# EAGLE design CHESSmate CPU (EAGLE 9.6.2)
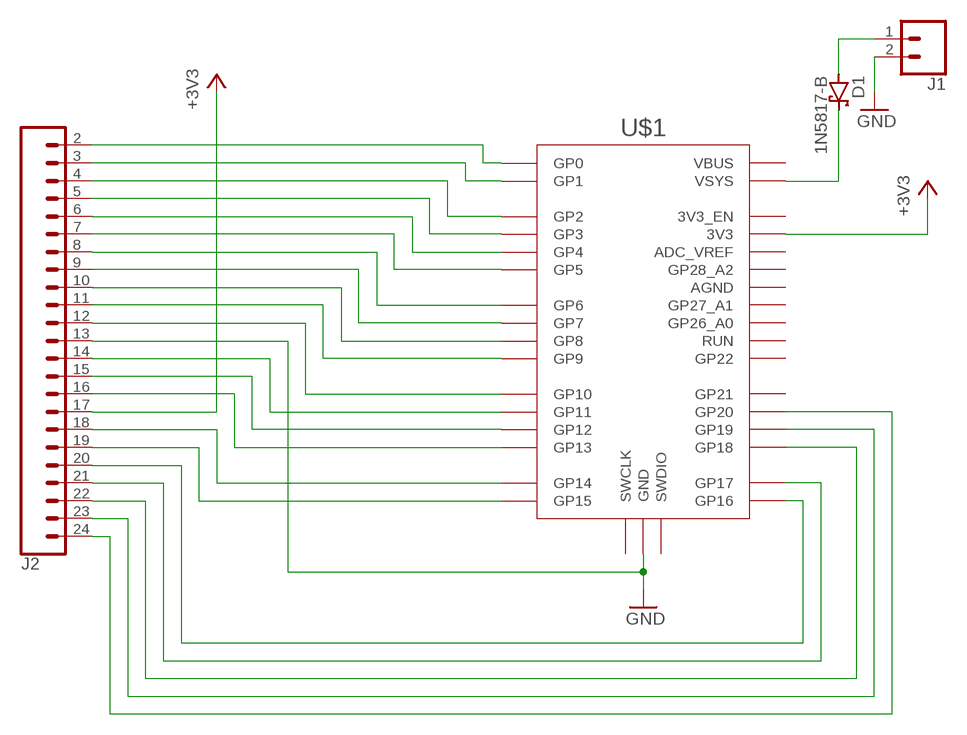
[diagram p0: schematic, sheet 1]

## Parts
D1  1N5817-B  [DO41-7.6]
J1  CONN_02  [1X02]
J2  CONN_23  [1X23]
U$1  RPI_PICO-TH  [RPI_PICO_TH]

## Nets
+3V3: J2.17 U$1.3V3
GND: J1.2 J2.13 U$1.GND@1(GND) U$1.GND@2(GND) U$1.GND@3(GND) U$1.GND@4(GND) U$1.GND@5(GND) U$1.GND@6(GND) U$1.GND@7(GND) U$1.GND@8(GND)
N$1: D1.C U$1.VSYS
N$2: D1.A J1.1
N$3: J2.2 U$1.GP0
N$4: J2.3 U$1.GP1
N$5: J2.4 U$1.GP2
N$6: J2.5 U$1.GP3
N$7: J2.6 U$1.GP4
N$8: J2.7 U$1.GP5
N$9: J2.8 U$1.GP6
N$10: J2.9 U$1.GP7
N$11: J2.10 U$1.GP8
N$12: J2.11 U$1.GP9
N$13: J2.14 U$1.GP11
N$14: J2.12 U$1.GP10
N$15: J2.15 U$1.GP12
N$16: J2.20 U$1.GP16
N$17: J2.21 U$1.GP17
N$18: J2.16 U$1.GP13
N$19: J2.18 U$1.GP14
N$20: J2.19 U$1.GP15
N$21: J2.22 U$1.GP18
N$22: J2.23 U$1.GP19
N$23: J2.24 U$1.GP20
Unconnected: U$1.3V3_EN U$1.ADC_VREF U$1.AGND U$1.GP21 U$1.GP22 U$1.GP26_A0 U$1.GP27_A1 U$1.GP28_A2 U$1.RUN U$1.SWCLK U$1.SWDIO U$1.VBUS

## Library data of the parts
D1 = diode:1N581*: 1.0A SCHOTTKY BARRIER RECTIFIER Source: http://www.diodes.com/datasheets/ds23001.pdf
J1 = SparkFun-Connectors:CONN_02: Multi connection point. Often used as Generic Header-pin footprint for 0.1 inch spaced/style header connections On any of the 0.1 inch spaced packages, you can populate with these: Break Away Headers - Straight <https://www.sparkfun.com/products/116> (PRT-00116) Break Away Male Headers - Right Angle <https://www.sparkfun.com/products/553> (PRT-00553) Female Headers <https://www.sparkfun.com/products/115> (PRT-00115) Break Away Headers - Machine Pin <https://www.sparkfun.com/products/117> (PRT-00117) Break Away Female Headers - Swiss Machine Pin <https://www.sparkfun.com/products/743> (PRT-00743) For SCREWTERMINALS and SPRING TERMINALS visit here: Screw Terimnals on SparkFun.com <https://www.sparkfun.com/search/results?term=Screw+Terminals> (5mm/3.5mm/2.54mm spacing) This device is also useful as a general connection point to wire up your design to another part of your project. Our various solder wires solder well into these plated through hole pads. Hook-Up Wire - Assortment (Stranded, 22 AWG) <https://www.sparkfun.com/products/11375> (PRT-11375) Hook-Up Wire - Assortment (Solid Core, 22 AWG) <https://www.sparkfun.com/products/11367> (PRT-11367) View the entire wire category on our website here <https://www.sparkfun.com/categories/141> Special notes: Molex polarized connector foot print use with: PRT-08233 with associated crimp pins and housings. 2.54_SCREWTERM for use with PRT-10571. 3.5mm Screw Terminal footprints for PRT-08084 5mm Screw Terminal footprints for use with PRT-08432
J2 = SparkFun-Connectors:CONN_23: Multi connection point. Often used as Generic Header-pin footprint for 0.1 inch spaced/style header connections On any of the 0.1 inch spaced packages, you can populate with these: Break Away Headers - Straight <https://www.sparkfun.com/products/116> (PRT-00116) Break Away Male Headers - Right Angle <https://www.sparkfun.com/products/553> (PRT-00553) Female Headers <https://www.sparkfun.com/products/115> (PRT-00115) Break Away Headers - Machine Pin <https://www.sparkfun.com/products/117> (PRT-00117) Break Away Female Headers - Swiss Machine Pin <https://www.sparkfun.com/products/743> (PRT-00743) For SCREWTERMINALS and SPRING TERMINALS visit here: Screw Terimnals on SparkFun.com <https://www.sparkfun.com/search/results?term=Screw+Terminals> (5mm/3.5mm/2.54mm spacing) This device is also useful as a general connection point to wire up your design to another part of your project. Our various solder wires solder well into these plated through hole pads. Hook-Up Wire - Assortment (Stranded, 22 AWG) <https://www.sparkfun.com/products/11375> (PRT-11375) Hook-Up Wire - Assortment (Solid Core, 22 AWG) <https://www.sparkfun.com/products/11367> (PRT-11367) View the entire wire category on our website here <https://www.sparkfun.com/categories/141> Special notes: Molex polarized connector foot print use with SKU : PRT-08231 with associated crimp pins and housings. 1MM SMD Version SKU: PRT-10208 NOTES ON THE VARIANTS LOCK and LOCK_LONGPADS... This footprint was designed to help hold the alignment of a through-hole component (i.e. 6-pin header) while soldering it into place. You may notice that each hole has been shifted either up or down by 0.005 of an inch from it's more standard position (which is a perfectly straight line). This slight alteration caused the pins (the squares in the middle) to touch the edges of the holes. Because they are alternating, it causes a "brace" to hold the component in place. 0.005 has proven to be the perfect amount of "off-center" position when using our standard breakaway headers. Although looks a little odd when you look at the bare footprint, once you have a header in there, the alteration is very hard to notice. Also,if you push a header all the way into place, it is covered up entirely on the bottom side.
U$1 = RaspberryPi_Pico:RPI_PICO

## Board
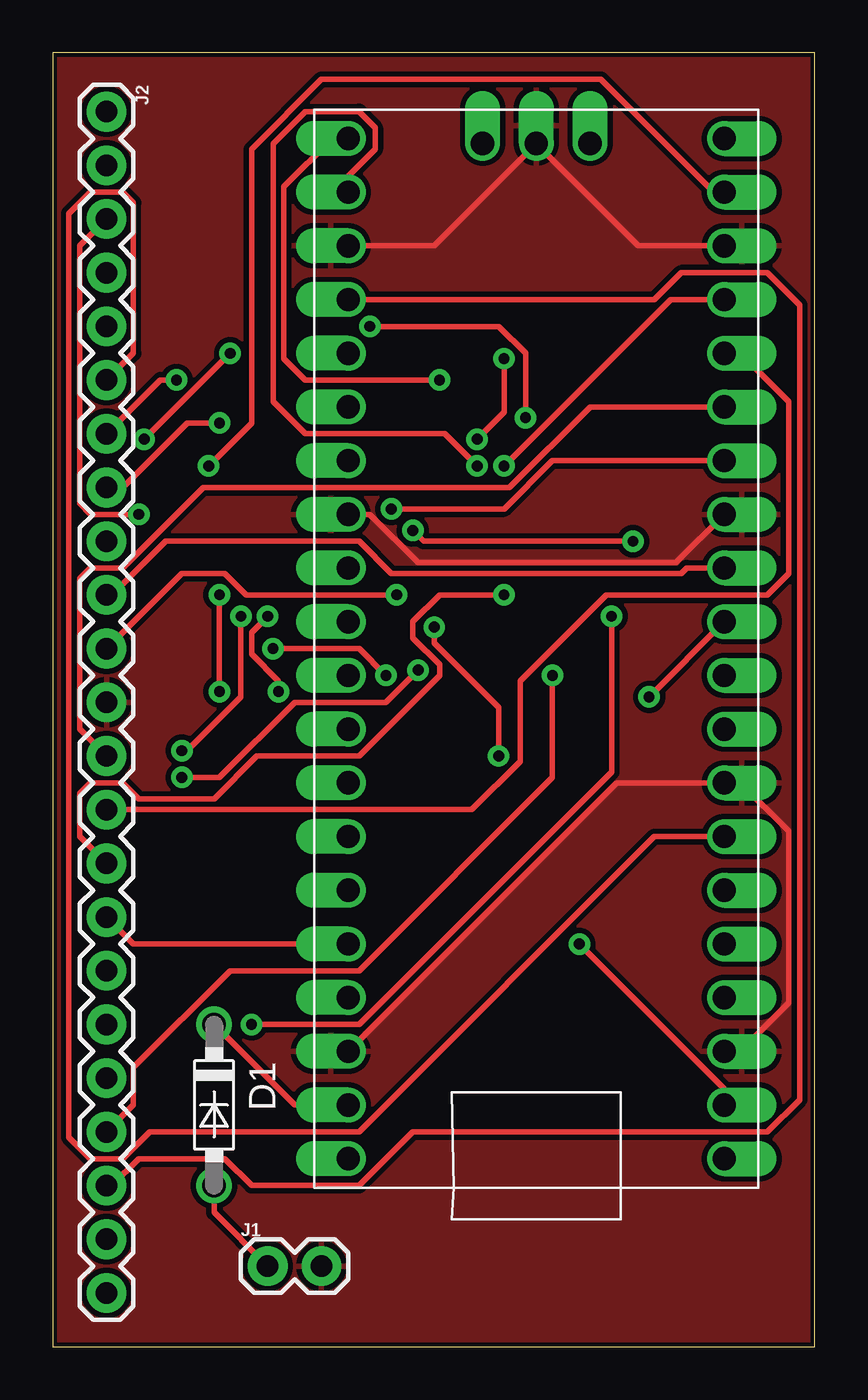
[diagram p1: board, top side]
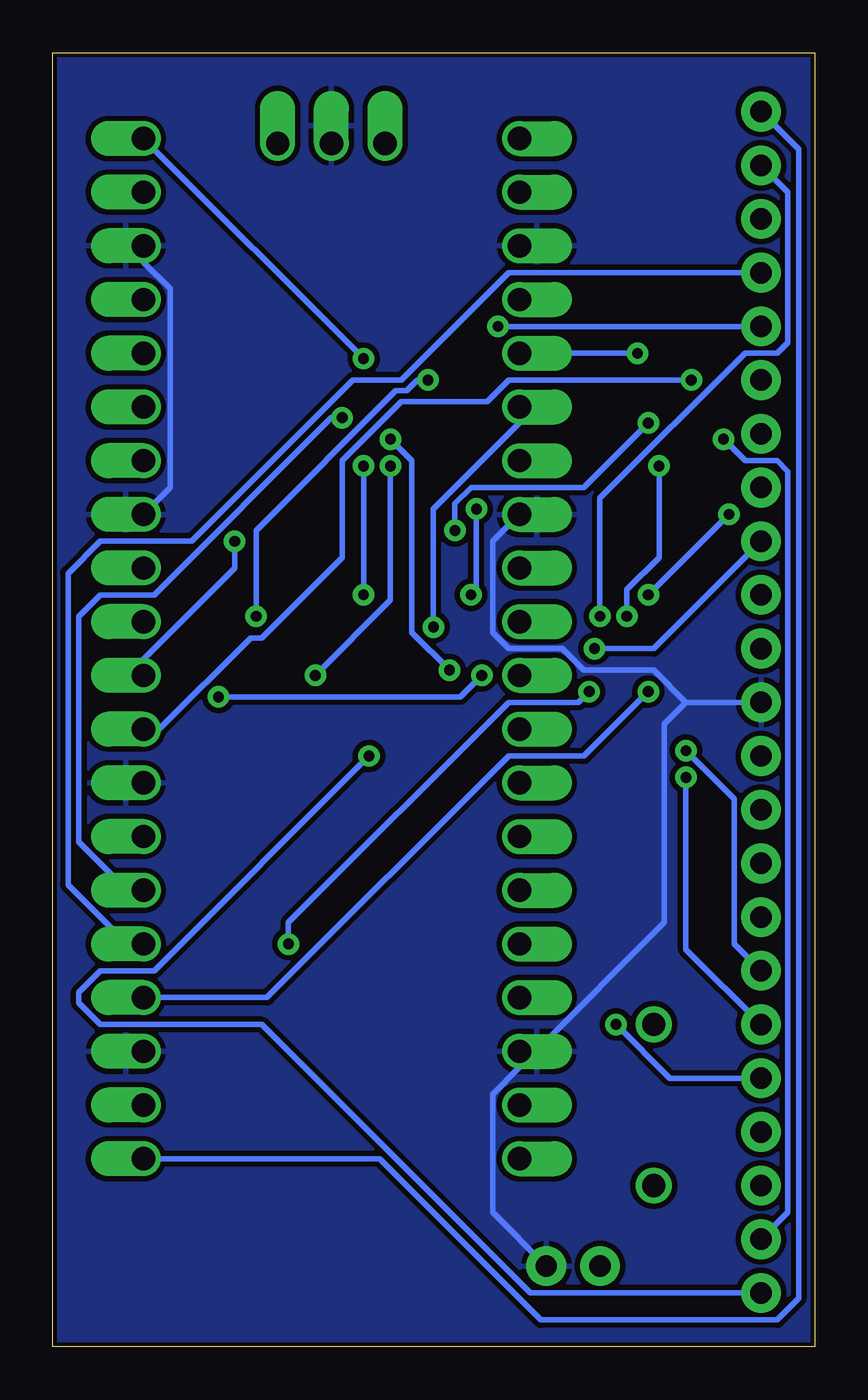
[diagram p2: board, bottom side, seen from below]

Size 36.03 x 61.2 mm. Coordinates in mm from the lower left corner, seen from the top.
Outline: 0,0 36.03,0 36.03,61.2 0,61.2 0,0
Copper layers (1*16): Top 0.035mm / dielectric 1.5mm / Bottom 0.035mm
Design rules "RetroSpy-2-layer-STANDARD": minimum track width 10mil, minimum drill 20mil, track to track 10mil, track to pad 8mil, pad to pad 8mil, via to via 10mil, smd to smd 8mil, copper to edge 8mil, drill to drill 8mil, minimum pad ring 10mil, minimum via ring 10mil, stop-mask expansion 4mil, vias tented up to drill 25mil, thermal gap 10mil

### Footprints (pad centres in the part's own frame; a part is rotated, then mirrored left to right if it is on the bottom)
DO41-7.6 = drill 1.1 pad 1.7: A 3.81,0; C -3.81,0
1X02 = drill 1.016 pad 1.88: 1 0,0; 2 2.54,0
1X23 = drill 1.016 pad 1.88: 2 -26.67,0; 3 -24.13,0; 4 -21.59,0; 5 -19.05,0; 6 -16.51,0; 7 -13.97,0; 8 -11.43,0; 9 -8.89,0; 10 -6.35,0; 11 -3.81,0; 12 -1.27,0; 13 1.27,0; 14 3.81,0; 15 6.35,0; 16 8.89,0; 17 11.43,0; 18 13.97,0; 19 16.51,0; 20 19.05,0; 21 21.59,0; 22 24.13,0; 23 26.67,0; 24 29.21,0
RPI_PICO_TH = drill 1.1 pad 1.6 offset: 3V3 8.89,13.97; 3V3_EN 8.89,16.51; ADC_VREF 8.89,11.43; AGND 8.89,6.35; GND@1 -8.89,19.05; GND@2 -8.89,6.35; GND@3 -8.89,-6.35; GND@4 -8.89,-19.05; GND@5 0,-23.9; GND@6 8.89,-19.05; GND@7 8.89,-6.35; GND@8 8.89,19.05; GP0 -8.89,24.13; GP1 -8.89,21.59; GP2 -8.89,16.51; GP3 -8.89,13.97; GP4 -8.89,11.43; GP5 -8.89,8.89; GP6 -8.89,3.81; GP7 -8.89,1.27; GP8 -8.89,-1.27; GP9 -8.89,-3.81; GP10 -8.89,-8.89; GP11 -8.89,-11.43; GP12 -8.89,-13.97; GP13 -8.89,-16.51; GP14 -8.89,-21.59; GP15 -8.89,-24.13; GP16 8.89,-24.13; GP17 8.89,-21.59; GP18 8.89,-16.51; GP19 8.89,-13.97; GP20 8.89,-11.43; GP21 8.89,-8.89; GP22 8.89,-3.81; GP26_A0 8.89,1.27; GP27_A1 8.89,3.81; GP28_A2 8.89,8.89; RUN 8.89,-1.27; SWCLK -2.54,-23.9; SWDIO 2.54,-23.9; VBUS 8.89,24.13; VSYS 8.89,21.59

### Placement (x,y rotation side)
D1  7.62,11.43 270 top
J1  10.16,3.81 0 top
J2  2.54,31.75 270 top
U$1  22.86,33.02 180 top

### Tracks (layer width: path | path; a pad name or v marks a point on that pad's centre or on a via)
+3V3
  Top 0.254: U$1.3V3 3.81,19.05 J2.17
GND
  Top 0.254: U$1.GND@6 18.03,52.07 22.86,56.9 | U$1.GND@4 27.69,52.07 22.86,56.9 | 22.86,56.9 U$1.GND@5 | U$1.GND@1 32.51,13.97 34.8,16.26 34.8,24.38 32.51,26.67 U$1.GND@2 26.67,26.67 U$1.GND@8 | U$1.GND@7 14.99,39.37 17.27,37.08 29.46,37.08 U$1.GND@3
  Bottom 0.254: J1.2 15.24,6.35 15.24,11.94 13.97,13.21 U$1.GND@8 13.21,13.97 7.11,20.07 7.11,29.46 6.1,30.48 | 6.1,30.48 J2.13 | 6.1,30.48 7.62,32 10.92,32 11.94,33.02 14.48,33.02 15.24,33.78 15.24,38.1 U$1.GND@7 | U$1.GND@4 31.75,51.31 30.48,50.04 30.48,40.64 U$1.GND@3
  pour Top: 0,62.23 36.83,62.23 36.83,0 0,0
  pour Bottom: 0,62.23 36.83,62.23 36.83,0 0,0
N$1
  Top 0.254: U$1.VSYS 11.43,11.43 D1.C
N$2
  Top 0.254: D1.A 7.62,6.35 J1.1
N$3
  Bottom 0.254: U$1.GP0 20.57,8.89 12.95,1.27 1.78,1.27 0.76,2.29 0.76,56.64 J2.2
N$4  (via drill 0.51)
  Top 0.254: U$1.GP1 31.75,12.19 v24.89,19.05 | v10.67,30.99 10.67,31.5 9.4,32.77 9.4,33.78 v10.16,34.54
  Bottom 0.254: v24.89,19.05 24.89,20.07 14.48,30.48 11.18,30.48 v10.67,30.99 | v10.16,34.54 10.16,40.13 3.3,46.99 1.78,46.99 1.27,47.5 1.27,54.61 J2.3
N$5  (via drill 0.51)
  Top 0.254: v7.87,35.56 v7.87,30.99 | v4.06,39.37 1.78,39.37 1.27,39.88 1.27,52.07 J2.4
  Bottom 0.254: U$1.GP2 25.91,16.51 14.48,27.94 10.92,27.94 v7.87,30.99 | v4.06,39.37 v7.87,35.56
N$6
  Bottom 0.254: U$1.GP3 32.51,19.05 35.31,21.84 35.31,36.58 33.78,38.1 29.46,38.1 21.84,45.72 19.56,45.72 14.48,50.8 J2.5
N$7  (via drill 0.51)
  Top 0.254: v22.35,43.94 22.35,46.99 21.08,48.26 v14.99,48.26
  Bottom 0.254: U$1.GP4 32.51,21.59 34.8,23.88 34.8,34.54 33.78,35.56 31.24,35.56 22.86,43.94 v22.35,43.94 | J2.6 v14.99,48.26
N$8
  Top 0.254: U$1.GP5 28.45,24.13 14.48,10.16 4.57,10.16 3.3,8.89 1.78,8.89 0.76,9.91 0.76,53.59 1.78,54.61 3.3,54.61 3.81,54.1 3.81,46.99 J2.7
N$9  (via drill 0.51)
  Top 0.254: v5.84,45.72 5.08,45.72 J2.8
  Bottom 0.254: U$1.GP6 30.99,29.21 26.67,33.53 26.16,33.53 22.35,37.34 22.35,41.91 19.56,44.7 15.49,44.7 14.48,45.72 v5.84,45.72
N$10  (via drill 0.51)
  Top 0.254: v27.43,38.1 17.53,38.1 v17.02,38.61 | v7.87,43.69 6.35,43.69 3.3,40.64 J2.9
  Bottom 0.254: U$1.GP7 31.75,32.51 27.43,36.83 v27.43,38.1 | v17.02,38.61 17.02,39.88 16.26,40.64 10.92,40.64 v7.87,43.69
N$11  (via drill 0.51)
  Top 0.254: v28.19,30.73 U$1.GP8 | v15.75,31.75 14.48,33.02 v10.41,33.02
  Bottom 0.254: v28.19,30.73 16.76,30.73 v15.75,31.75 | v10.41,33.02 7.62,33.02 J2.10
N$12
  Top 0.254: U$1.GP9 29.97,36.83 29.72,36.58 16,36.58 14.48,38.1 5.33,38.1 2.79,35.56 J2.11
N$13
  Top 0.254: U$1.GP11 25.4,44.45 21.59,40.64 7.11,40.64 3.3,36.83 1.78,36.83 1.27,36.32 1.27,29.21 J2.14
N$14  (via drill 0.51)
  Top 0.254: U$1.GP10 23.62,41.91 21.34,39.62 v16,39.62 | v16.26,35.56 9.14,35.56 8.13,36.58 6.1,36.58 J2.12
  Bottom 0.254: v16,39.62 16,35.81 v16.26,35.56
N$15
  Top 0.254: U$1.GP12 32.51,46.99 34.8,44.7 34.8,36.58 33.78,35.56 26.16,35.56 22.1,31.5 22.1,27.69 19.81,25.4 J2.15
N$16  (via drill 0.51)
  Top 0.254: U$1.GP16 13.21,57.15 10.92,54.86 10.92,46.74 11.94,45.72 v18.29,45.72 | v26.42,34.54 26.42,27.18 14.48,15.24 v9.4,15.24
  Bottom 0.254: v18.29,45.72 18.8,45.72 19.3,45.21 19.81,45.21 26.42,38.61 v26.42,34.54 | v9.4,15.24 6.86,12.7 J2.20
N$17  (via drill 0.51)
  Top 0.254: U$1.GP17 13.97,55.37 15.24,56.64 15.24,57.66 14.48,58.42 11.94,58.42 10.41,56.9 10.41,44.7 11.94,43.18 18.54,43.18 v20.07,41.66 | v23.62,31.75 23.62,26.92 14.48,17.78 8.38,17.78 3.81,13.21 3.81,11.43 J2.21
  Bottom 0.254: v20.07,41.66 20.07,35.31 v23.62,31.75
N$18  (via drill 0.51)
  Top 0.254: U$1.GP13 29.21,49.53 v21.34,41.66 | v21.34,35.56 18.29,35.56 17.02,34.29 17.02,33.53 18.29,32.26 18.29,31.75 14.48,27.94 9.65,27.94 7.62,25.91 4.06,25.91 3.3,26.67 1.78,26.67 1.27,26.16 1.27,24.13 J2.16
  Bottom 0.254: v21.34,35.56 v21.34,41.66
N$19  (via drill 0.51)
  Top 0.254: U$1.GP14 31.24,54.61 25.91,59.94 12.7,59.94 9.4,56.64 9.4,43.69 v7.37,41.66 | v8.89,34.54 8.89,30.73 6.35,28.19 v6.1,28.19
  Bottom 0.254: v7.37,41.66 7.37,37.34 8.89,35.81 v8.89,34.54 | v6.1,28.19 3.81,25.91 3.81,19.05 J2.18
N$20  (via drill 0.51)
  Top 0.254: v21.34,46.74 21.34,44.2 v20.07,42.93 | v17.27,32 15.75,30.48 11.43,30.48 7.87,26.92 v6.1,26.92
  Bottom 0.254: v21.34,46.74 U$1.GP15 | v20.07,42.93 19.05,41.91 19.05,33.78 v17.27,32 | v6.1,26.92 6.1,18.8 J2.19
N$21
  Top 0.254: U$1.GP18 28.45,49.53 29.72,50.8 33.78,50.8 35.31,49.28 35.31,11.68 33.78,10.16 17.02,10.16 14.48,7.62 9.4,7.62 8.13,8.89 4.06,8.89 2.79,7.62 J2.22
N$22  (via drill 0.51)
  Top 0.254: v4.32,42.93 v8.38,46.99
  Bottom 0.254: v8.38,46.99 U$1.GP19 | v4.32,42.93 3.3,41.91 1.78,41.91 1.27,41.4 1.27,6.35 J2.23
N$23  (via drill 0.51)
  Top 0.254: v18.03,34.04 18.03,33.27 21.08,30.23 v21.08,27.94
  Bottom 0.254: U$1.GP20 13.97,43.69 18.03,39.62 v18.03,34.04 | v21.08,27.94 31.24,17.78 33.78,17.78 34.8,16.76 34.8,16.26 33.78,15.24 26.16,15.24 13.46,2.54 J2.24